# EAGLE design Group5Approved (EAGLE 9.2.0)
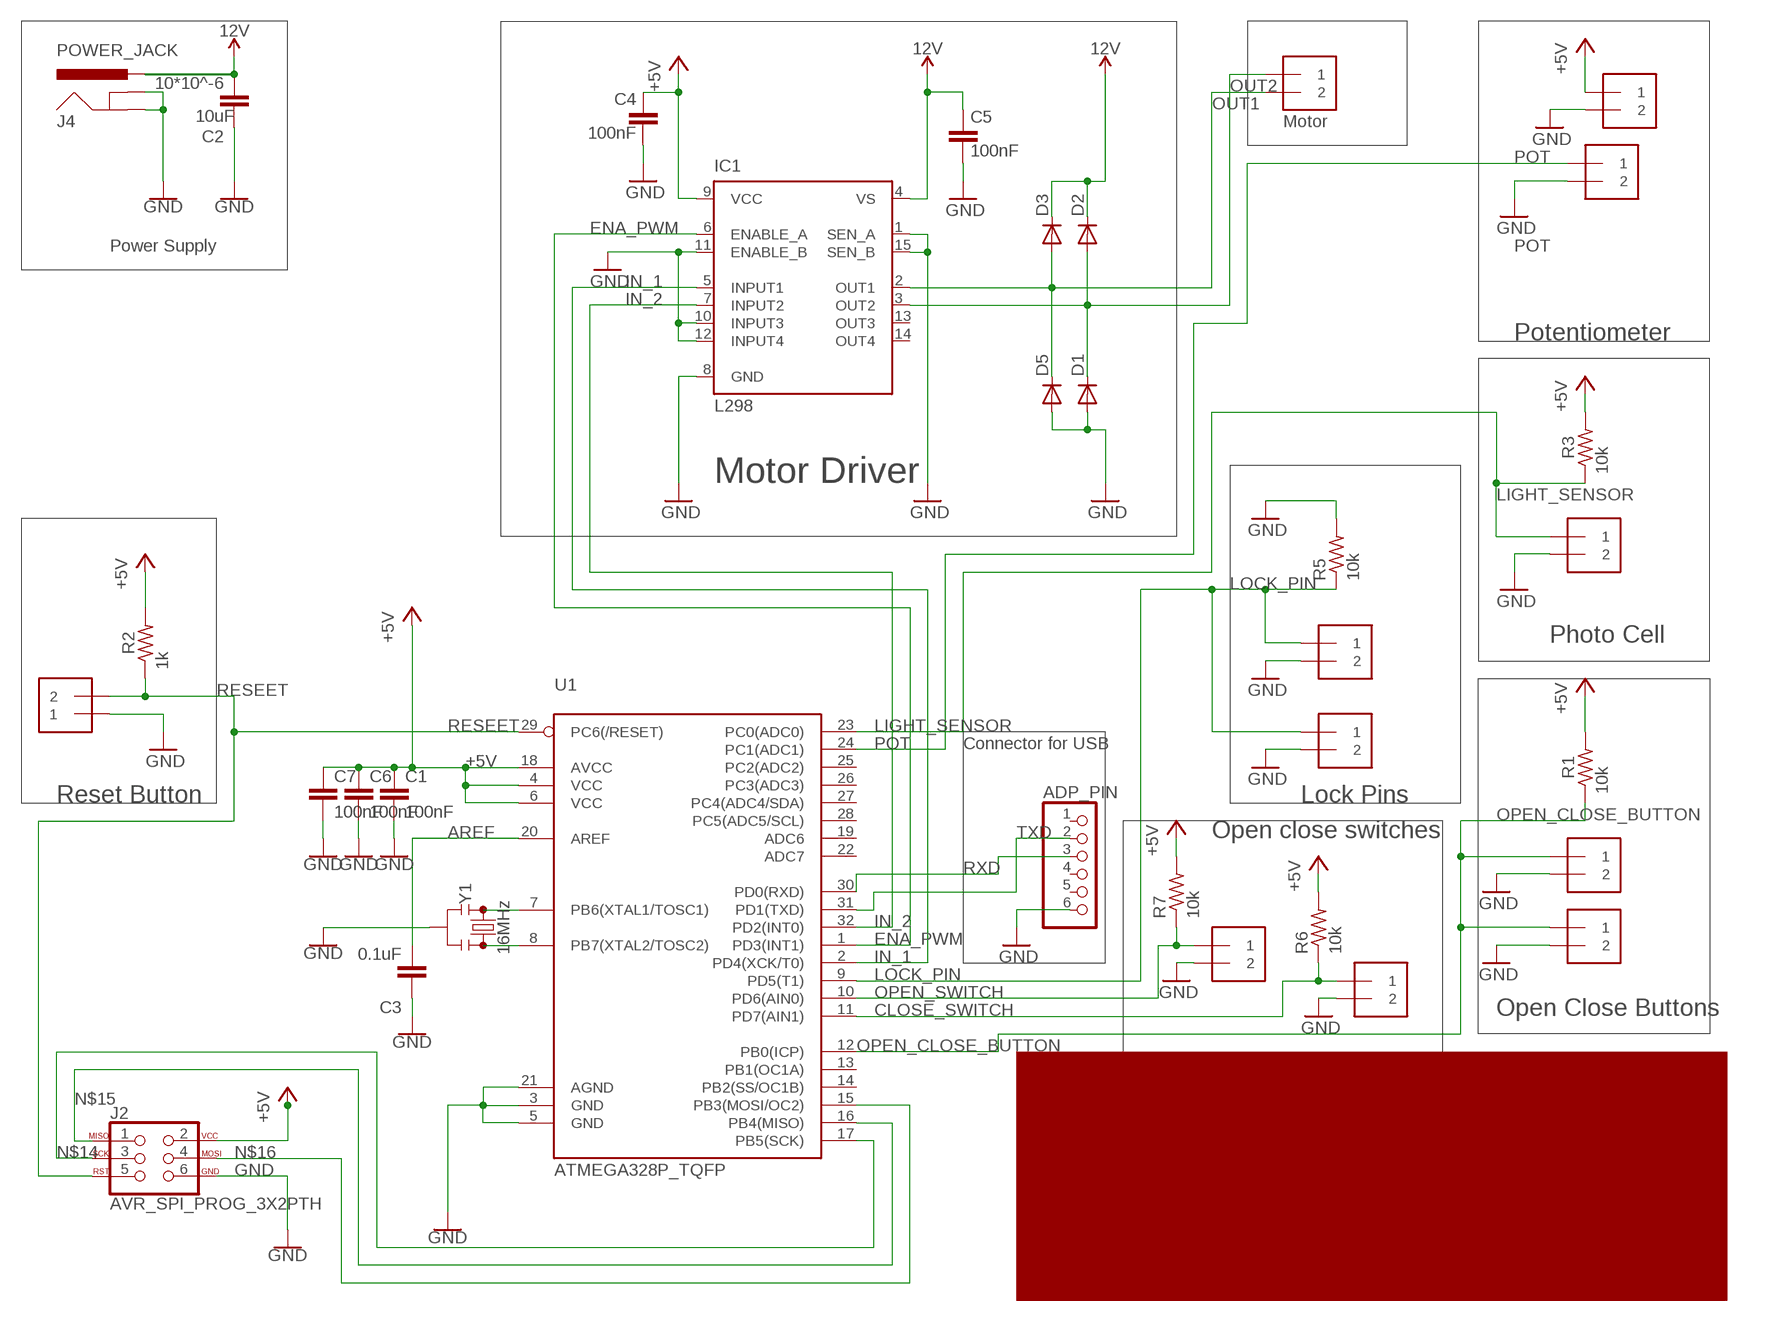
[diagram p0: schematic, sheet 1]

## Parts
ADP_PIN  PINHD-1X6  [1X06]
C1  100nF  C-EUC0805  [C0805]
C2  10*10^-6  C-EUC0805  [C0805]
C3  0.1uF  C-EUC0805  [C0805]
C4  100nF  C-EUC0805  [C0805]
C5  100nF  C-EUC0805  [C0805]
C6  100nF  C-EUC0805  [C0805]
C7  100nF  C-EUC0805  [C0805]
CLOSESWITCH  1X2-3.5MM  [1X2-3.5MM]
D1  DIODE-DO214AA  [DO214AA]
D2  DIODE-DO214AA  [DO214AA]
D3  DIODE-DO214AA  [DO214AA]
D5  DIODE-DO214AA  [DO214AA]
IC1  L298  [MULTIWATT-15]
INSIDE_BUTTON  1X2-3.5MM  [1X2-3.5MM]
J2  AVR_SPI_PROG_3X2PTH  [2X3]
J4  POWER_JACK  [POWER_JACK_PTH]
LIGHT_SENSOR  1X2-3.5MM  [1X2-3.5MM]
LOCK_PIN1  1X2-3.5MM  [1X2-3.5MM]
LOCK_PIN2  1X2-3.5MM  [1X2-3.5MM]
MOTOR  1X2-3.5MM  [1X2-3.5MM]
OPEN_SWITCH  1X2-3.5MM  [1X2-3.5MM]
OUTSIDE_BUTTON  1X2-3.5MM  [1X2-3.5MM]
POT  1X2-3.5MM  [1X2-3.5MM]
POTPOWER  1X2-3.5MM  [1X2-3.5MM]
R1  10k  R-US_M0805  [M0805]
R2  1k  R-US_M0805  [M0805]
R3  10k  R-US_M0805  [M0805]
R5  10k  R-US_M0805  [M0805]
R6  10k  R-US_M0805  [M0805]
R7  10k  R-US_M0805  [M0805]
RESETBUTTON  1X2-3.5MM  [1X2-3.5MM]
U1  ATMEGA328P_TQFP  [TQFP32-08]
Y1  16MHz  RESONATOR-16MHZSMD_3.2X1.3  [RESONATOR-SMD-3.2X1.3]

## Nets
12V [Power]: C2.2 C5.1 D2.C D3.C IC1.4(VS) J4.PWR
+5V: C1.1 C4.1 C6.1 C7.1 IC1.9(VCC) J2.2 POTPOWER.1 R1.2 R2.2 R3.2 R6.2 R7.2 U1.4(VCC) U1.6(VCC) U1.18(AVCC)
AREF: C3.2 U1.20(AREF)
CLOSE_SWITCH: CLOSESWITCH.1 R6.1 U1.11(PD7(AIN1))
ENA_PWM: IC1.6(ENABLE_A) U1.1(PD3(INT1))
GND [gnd]: ADP_PIN.6 C1.2 C2.1 C3.1 C4.2 C5.2 C6.2 C7.2 CLOSESWITCH.2 D1.A D5.A IC1.1(SEN_A) IC1.8(GND) IC1.10(INPUT3) IC1.11(ENABLE_B) IC1.12(INPUT4) IC1.15(SEN_B) INSIDE_BUTTON.2 J2.6 J4.GND J4.GNDBREAK LIGHT_SENSOR.2 LOCK_PIN1.2 LOCK_PIN2.2 OPEN_SWITCH.2 OUTSIDE_BUTTON.2 POT.2 POTPOWER.2 R5.2 RESETBUTTON.1 U1.3(GND) U1.5(GND) U1.21(AGND) Y1.2
IN_1: IC1.5(INPUT1) U1.2(PD4(XCK/T0))
IN_2: IC1.7(INPUT2) U1.32(PD2(INT0))
LIGHT_SENSOR: LIGHT_SENSOR.1 R3.1 U1.23(PC0(ADC0))
LOCK_PIN: LOCK_PIN1.1 LOCK_PIN2.1 R5.1 U1.9(PD5(T1))
N$14: J2.3 U1.17(PB5(SCK))
N$15: J2.1 U1.16(PB4(MISO))
N$16: J2.4 U1.15(PB3(MOSI/OC2))
N$19: U1.7(PB6(XTAL1/TOSC1)) Y1.1
N$20: U1.8(PB7(XTAL2/TOSC2)) Y1.3
OPEN_CLOSE_BUTTON: INSIDE_BUTTON.1 OUTSIDE_BUTTON.1 R1.1 U1.12(PB0(ICP))
OPEN_SWITCH: OPEN_SWITCH.1 R7.1 U1.10(PD6(AIN0))
OUT1 [Motor line]: D3.A D5.C IC1.2(OUT1) MOTOR.2
OUT2 [Motor line]: D1.C D2.A IC1.3(OUT2) MOTOR.1
POT: POT.1 U1.24(PC1(ADC1))
RESEET: J2.5 R2.1 RESETBUTTON.2 U1.29(PC6(/RESET))
RXD: ADP_PIN.3 U1.30(PD0(RXD))
TXD: ADP_PIN.2 U1.31(PD1(TXD))
Unconnected: ADP_PIN.1 ADP_PIN.4 ADP_PIN.5 IC1.13(OUT3) IC1.14(OUT4) U1.13(PB1(OC1A)) U1.14(PB2(SS/OC1B)) U1.19(ADC6) U1.22(ADC7) U1.25(PC2(ADC2)) U1.26(PC3(ADC3)) U1.27(PC4(ADC4/SDA)) U1.28(PC5(ADC5/SCL))

## Notes on the sheet
- Motor
- Power Supply
- Potentiometer
- Motor Driver
- Photo Cell
- Connector for USB
- Reset Button | Lock Pins
- Open close switches
- Open Close Buttons
- Group 5
- Light Controlled Chicken door opener

## Library data of the parts
ADP_PIN = pinhead:PINHD-1X6: PIN HEADER
C1 C3-C7 = rcl:C-EU: CAPACITOR, European symbol; SPICEPREFIX: C
C2 = rcl:C-EU: CAPACITOR, European symbol; SPICEPREFIX: 10uF
CLOSESWITCH INSIDE_BUTTON LIGHT_SENSOR LOCK_PIN1 LOCK_PIN2 MOTOR OPEN_SWITCH OUTSIDE_BUTTON POT POTPOWER RESETBUTTON = adafruit:1X2: 3.5mm Terminal block http://www.ladyada.net/library/pcb/eaglelibrary.html
D1-D3 D5 = diode:DIODE-: DIODE
IC1 = st-microelectronics:L298: DUAL FULL-BRIDGE DRIVER; MPN: L298N; OC_FARNELL: 1589425; OC_NEWARK: 32M1527
J2 = SparkFun-Connectors:AVR_SPI_PROG_3X2: AVR ISP 6 Pin This is the reduced ISP connector for AVR programming. Common on Arduino. This footprint will take up less PCB space and can be used with a 10-pin to 6-pin adapter such as SKU: BOB-08508 **Special note about "TEST_POINT" package. The stop mask is on the top side, so if you want your programming test points to be on the bottom of your board, make sure to place this package on the bottom side of the board. This also ensure that the orientation to program from the bottom side will be correct. SparkFun Products: SparkFun ISP Pogo Adapter <https://www.sparkfun.com/products/11591> - NS Tiny AVR Programmer <https://www.sparkfun.com/products/11801> -PTH
J4 = SparkFun-Connectors:POWER_JACK: Power Jack Connector This is the standard 5.5mm barrel jack for power. The PTH is the most common, proven, reliable, footprint. The Slot footprint only works if the mill layer is transmitted to the PCB fab house so be warned. Here are the connectors we sell at SparkFun: DC Barrel Power Jack/Connector <https://www.sparkfun.com/products/119> (PRT-00119) DC Barrel Power Jack/Connector (SMD) <https://www.sparkfun.com/products/12748> (PRT-12748) DC Barrel Jack Adapter - Breadboard Compatible <https://www.sparkfun.com/products/10811> (PRT-10811) It is used on this SparkFun product (and many, many others): SparkFun RedBoard - Programmed with Arduino <https://www.sparkfun.com/products/12757> (DEV-12757) Also, if you need a mating power supply or connector, please check these out: Wall Adapter Power Supply - 9VDC 650mA <https://www.sparkfun.com/products/298> (TOL-00298) DC Barrel Jack Adapter - Male <https://www.sparkfun.com/products/10287> (PRT-10287); PROD_ID: CONN-08197
R1-R3 R5-R7 = rcl:R-US_: RESISTOR, American symbol; SPICEPREFIX: R
U1 = SparkFun-IC-Microcontroller:ATMEGA328P_TQFP: Popular 328P in QFP Storefront component: ATmega328 - TQFP <https://www.sparkfun.com/products/13448> (COM-13448) Datasheet <http://www.sparkfun.com/datasheets/Components/SMD/ATMega328.pdf> SparkFun Products SparkFun RedBoard - Programmed with Arduino <https://www.sparkfun.com/products/12757> (DEV-12757) Arduino Pro Mini 328 - 5V/16MHz <https://www.sparkfun.com/products/11113> (DEV-11113) Arduino Pro Mini 328 - 3.3V/8MHz <https://www.sparkfun.com/products/11114> (DEV-11114) SparkFun OpenLog <https://www.sparkfun.com/products/13712> (DEV-13712) SparkFun MicroView - OLED Arduino Module <https://www.sparkfun.com/products/12923> (DEV-12923) SparkFun Digital Sandbox <https://www.sparkfun.com/products/12651> (DEV-12651) SparkFun PicoBoard <https://www.sparkfun.com/products/11888> (WIG-11888) Arduino Fio <https://www.sparkfun.com/products/10116> (DEV-10116) LilyPad Arduino 328 Main Board <https://www.sparkfun.com/products/13342> (DEV-13342) SparkFun RedStick <https://www.sparkfun.com/products/13741> (DEV-13741) LilyPad MP3 <https://www.sparkfun.com/products/11013> (DEV-11013) LilyPad Arduino SimpleSnap <https://www.sparkfun.com/products/10941> (DEV-10941) SparkFun Stepoko <https://www.sparkfun.com/products/13899> (ROB-13899) SparkFun Geiger Counter <https://www.sparkfun.com/products/11345> (SEN-11345) SparkFun EL Sequencer <https://www.sparkfun.com/products/12781> (COM-12781) Arduino Pro 328 - 5V/16MHz <https://www.sparkfun.com/products/10915> (DEV-10915) CryptoCape <https://www.sparkfun.com/products/12773> (DEV-12773) SparkFun IR Thermometer Evaluation Board - MLX90614 <https://www.sparkfun.com/products/10740> (SEN-10740) SparkFun RedBot Mainboard <https://www.sparkfun.com/products/12097> (ROB-12097) Arduino Pro 328 - 3.3V/8MHz <https://www.sparkfun.com/products/10914> (DEV-10914) SparkFun Block for Intel® Edison - Arduino <https://www.sparkfun.com/products/13036> (DEV-13036) SparkFun Simon Says - Surface Mount Soldering Kit <https://www.sparkfun.com/products/10935> (KIT-10935) SparkFun 7-Segment Serial Display - Red <https://www.sparkfun.com/products/11441> (COM-11441) SparkFun 7-Segment Serial Display - White <https://www.sparkfun.com/products/11629> (COM-11629) SparkFun 7-Segment Serial Display - Yellow <https://www.sparkfun.com/products/11443> (COM-11443) SparkFun 7-Segment Serial Display - Kelly Green <https://www.sparkfun.com/products/11440> (COM-11440) SparkFun 7-Segment Serial Display - Blue <https://www.sparkfun.com/products/11442> (COM-11442) SparkFun OpenSegment Serial Display - 20mm (Blue) <https://www.sparkfun.com/products/11647> (COM-11647) SparkFun OpenSegment Serial Display - 20mm (Green) <https://www.sparkfun.com/products/11646> (COM-11646) SparkFun OpenSegment Serial Display - 20mm (White) <https://www.sparkfun.com/products/11648> (COM-11648) SparkFun OpenSegment Serial Display - 20mm (Red) <https://www.sparkfun.com/products/11644> (COM-11644) SparkFun OpenSegment Serial Display - 20mm (Yellow) <https://www.sparkfun.com/products/11645> (COM-11645) SparkFun OpenSegment Shield <https://www.sparkfun.com/products/13190> (DEV-13190); PROD_ID: IC-09069
Y1 = SparkFun-Clocks:RESONATOR-16MHZ: 16MHz Resonator Digikey Example <http://www.digikey.com/product-detail/en/murata-electronics-north-america/CSTCE16M0V53-R0/490-1198-1-ND/584635> Frequency: 16MHz Frequency Stability: ±0.3% Frequency Tolerance: ±0.5% Capacitance: 15pF SparkFun Products SparkFun OpenLog <https://www.sparkfun.com/products/13712> SparkFun MicroView - OLED Arduino Module <https://www.sparkfun.com/products/12923>; PROD_ID: XTAL-08900

## Net classes
0 default: width 0.1 mm, drill 0.8 mm, clearance 0.152 mm
1 Power: width 1.27 mm, drill 0.8 mm, clearance 0.152 mm
2 gnd: width 0.03 mm, drill 0.559 mm, clearance 0.152 mm
3 Motor line: width 0.12 mm, drill 0.8 mm, clearance 0.2 mm

## Board
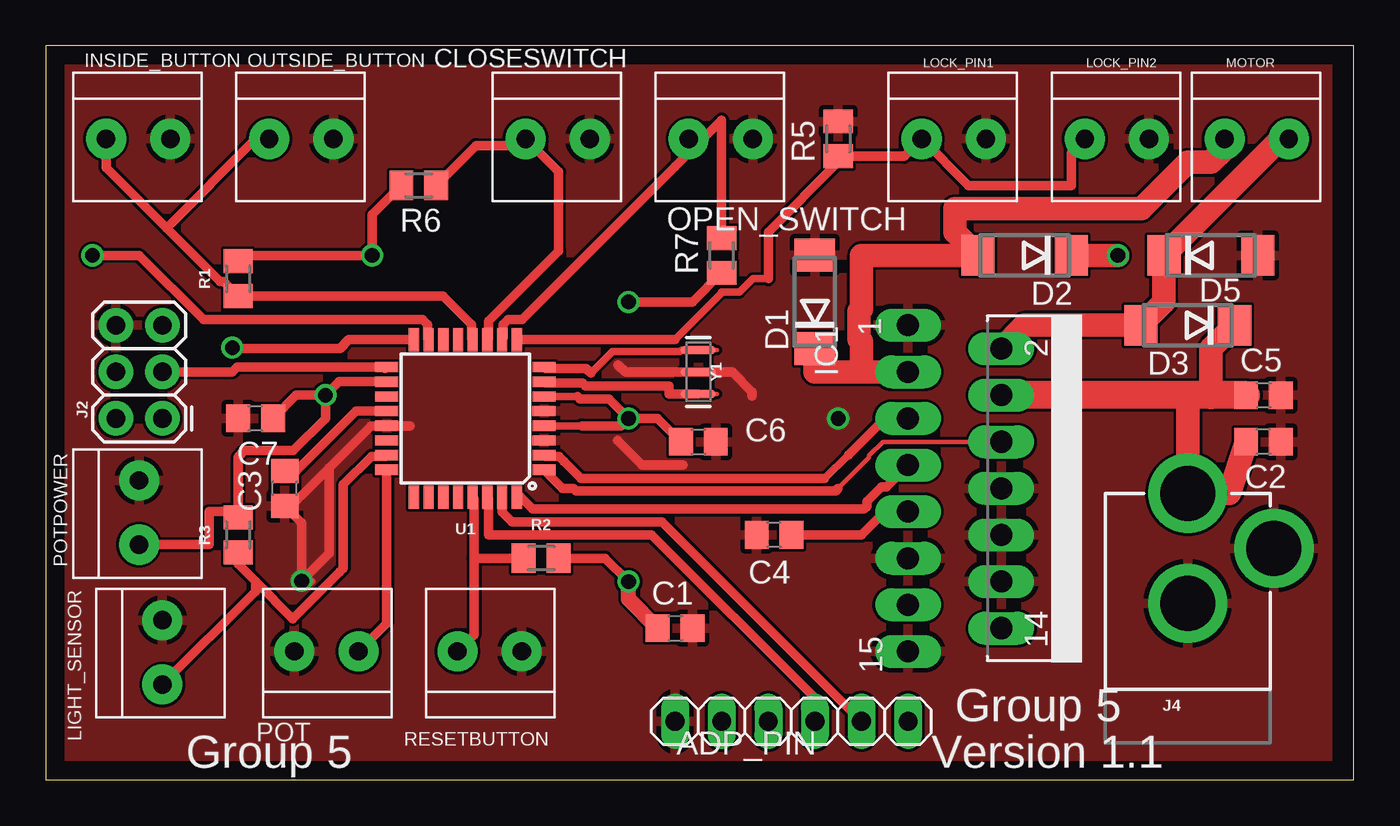
[diagram p1: board, top side]
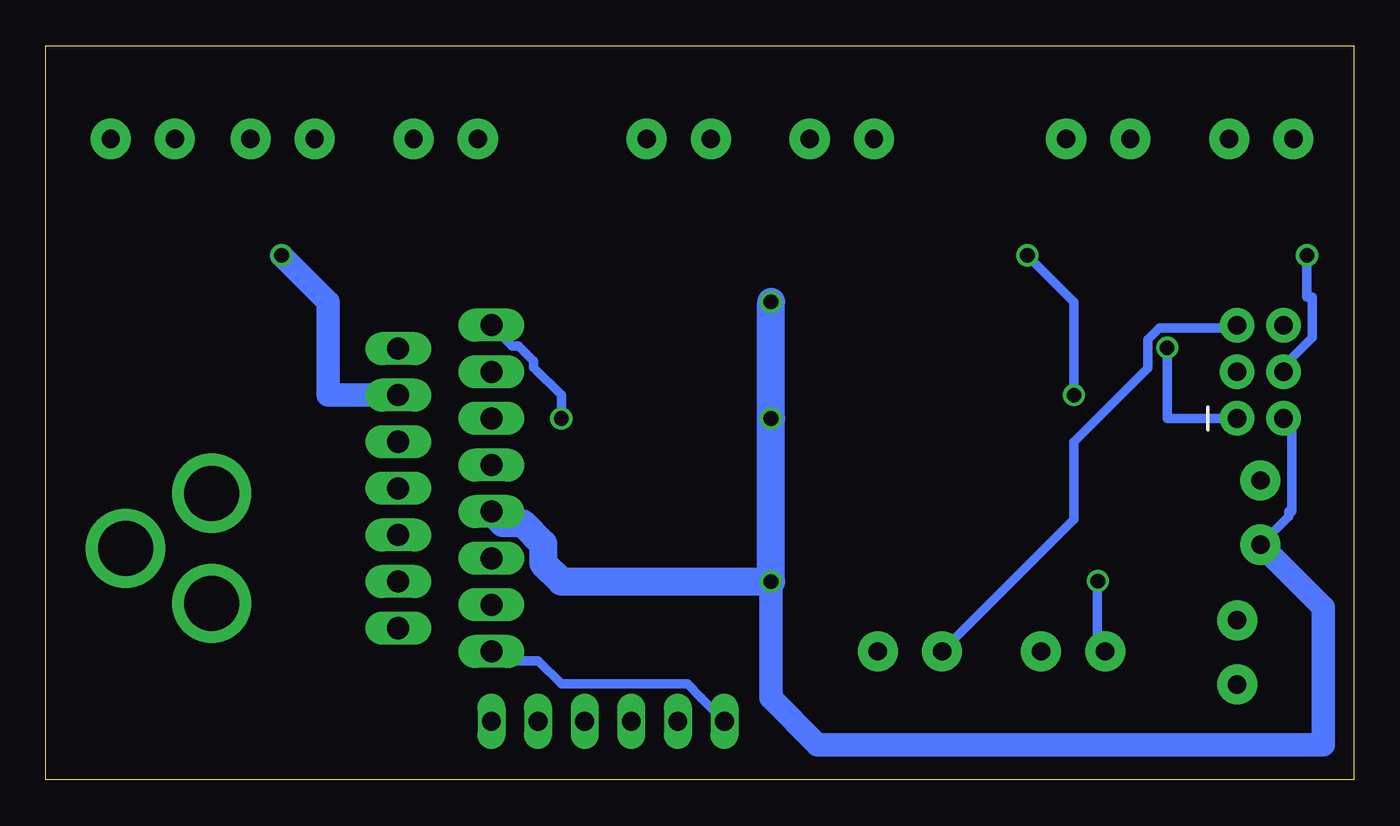
[diagram p2: board, bottom side, seen from below]

Size 71.27 x 40 mm. Coordinates in mm from the lower left corner, seen from the top.
Outline: 0,0 71.27,0 71.27,40 0,40 0,0
Copper layers (1*16): Top 0.035mm / dielectric 1.5mm / Bottom 0.035mm
Design rules "default": minimum track width 6mil, minimum drill 0.35mm, track to track 6mil, track to pad 6mil, pad to pad 6mil, via to via 6mil, smd to smd 6mil, copper to edge 40mil, drill to drill 6mil, minimum pad ring 10mil, minimum via ring 8mil, stop-mask expansion 4mil, vias tented up to drill 0mil, thermal gap 10mil

### Footprints (pad centres in the part's own frame; a part is rotated, then mirrored left to right if it is on the bottom)
1X06 = drill 1.016 long: 1 -6.35,0; 2 -3.81,0; 3 -1.27,0; 4 1.27,0; 5 3.81,0; 6 6.35,0
C0805 = smd 1.3 x 1.5: 1 -0.95,0; 2 0.95,0
1X2-3.5MM = drill 1 pad 2.184: 1 1.8,0; 2 -1.7,0
DO214AA = smd 1.8 x 2.2: A 2.55,0; C -2.55,0
MULTIWATT-15 = drill 1.2 long: 1 -8.89,-7.62; 2 -7.62,-2.54; 3 -6.35,-7.62; 4 -5.08,-2.54; 5 -3.81,-7.62; 6 -2.54,-2.54; 7 -1.27,-7.62; 8 0,-2.54; 9 1.27,-7.62; 10 2.54,-2.54; 11 3.81,-7.62; 12 5.08,-2.54; 13 6.35,-7.62; 14 7.62,-2.54; 15 8.89,-7.62
2X3 = drill 1.016 pad 1.88: 1 0,0; 2 0,2.54; 3 2.54,0; 4 2.54,2.54; 5 5.08,0; 6 5.08,2.54
POWER_JACK_PTH = drill 2.997 pad 4.318: GND 0,7.7; GNDBREAK 4.7,10.7; PWR 0,13.7
M0805 = smd 1.3 x 1.6: 1 -0.95,0; 2 0.95,0
TQFP32-08 = smd 1.27 x 0.559: 1 -4.293,2.8; 2 -4.293,2; 3 -4.293,1.2; 4 -4.293,0.4; 5 -4.293,-0.4; 6 -4.293,-1.2; 7 -4.293,-2; 8 -4.293,-2.8; 17 4.293,-2.8; 18 4.293,-2; 19 4.293,-1.2; 20 4.293,-0.4; 21 4.293,0.4; 22 4.293,1.2; 23 4.293,2; 24 4.293,2.8 | smd 0.559 x 1.27: 9 -2.8,-4.293; 10 -2,-4.293; 11 -1.2,-4.293; 12 -0.4,-4.293; 13 0.4,-4.293; 14 1.2,-4.293; 15 2,-4.293; 16 2.8,-4.293; 25 2.8,4.293; 26 2,4.293; 27 1.2,4.293; 28 0.4,4.293; 29 -0.4,4.293; 30 -1.2,4.293; 31 -2,4.293; 32 -2.8,4.293
RESONATOR-SMD-3.2X1.3 = smd 0.45 x 1.905: 1 -1.2,0; 2 0,0; 3 1.2,0

### Placement (x,y rotation side)
ADP_PIN  40.64,3.18 180 top
C1  34.29,8.26 0 top
C2  66.36,18.42 180 top
C3  13.02,15.88 90 top
C4  39.69,13.34 180 top
C5  66.36,20.96 0 top
C6  35.56,18.42 0 top
C7  11.43,19.69 180 top
CLOSESWITCH  27.94,34.93 180 top
D1  41.91,26.04 90 top
D2  53.34,28.58 180 top
D3  62.23,24.77 180 top
D5  63.49,28.58 0 top
IC1  54.61,15.88 270 top
INSIDE_BUTTON  5.08,34.93 180 top
J2  6.35,19.69 90 top
J4  62.23,1.91 0 top
LIGHT_SENSOR  6.35,6.99 270 top
LOCK_PIN1  49.53,34.93 180 top
LOCK_PIN2  58.42,34.93 180 top
MOTOR  66.04,34.93 180 top
OPEN_SWITCH  36.83,34.93 180 top
OUTSIDE_BUTTON  13.97,34.93 180 top
POT  15.24,6.99 0 top
POTPOWER  5.08,14.61 270 top
R1  10.48,27.31 90 top
R2  26.99,12.07 0 top
R3  10.48,13.34 90 top
R5  43.18,34.93 90 top
R6  20.32,32.39 180 top
R7  36.83,28.58 270 top
RESETBUTTON  24.13,6.99 0 top
U1  22.86,19.69 180 top
Y1  35.56,22.23 90 top

### Tracks (layer width: path | path; a pad name or v marks a point on that pad's centre or on a via)
12V  (via drill 0.8)
  Top 1.27: v58.42,28.58 D2.C | D3.C 63.5,23.49 63.5,20.96 | 62.23,20.96 J4.PWR 64.5,15.61 C2.2
  Top 1.524: C5.1 63.5,20.96 62.23,20.96 IC1.4
  Bottom 1.27: v58.42,28.58 55.88,26.04 55.88,20.96 IC1.4
+5V  (via drill 0.8)
  Top 0.406: U1.4 29.21,19.29 | U1.6 28.98,20.89
  Top 0.508: R1.2 10.8,28.58 v17.78,28.58 17.78,30.8 R6.2 | v31.75,10.8 30.48,12.07 R2.2 | v31.75,26.04 35.24,26.04 R7.2 | v15.24,20.96 15.24,19.69 13.48,17.93 10.81,17.93 10.48,17.6 R3.2 10.48,14.61 8.89,14.61 8.89,12.81 POTPOWER.1 | 28.98,20.89 29.12,20.74 30.7,20.74 v31.75,19.69 | 29.21,19.29 31.35,19.29 v31.75,19.69 | U1.18 15.97,21.69 v15.24,20.96 | C4.1 44.45,13.34 45.72,14.61 IC1.9 | C7.1 13.65,20.96 v15.24,20.96 | C6.1 33.34,19.69 v31.75,19.69
  Top 0.813: C1.1 31.75,9.85 v31.75,10.8
  Bottom 0.508: v17.78,28.58 15.24,26.04 v15.24,20.96 | POTPOWER.1 3.54,14.34 3.54,14.61 3.38,14.61 3.38,19.69 J2.2
  Bottom 1.27: v31.75,10.8 31.75,4.45 29.21,1.91 1.65,1.91 1.65,9.38 POTPOWER.1
  Bottom 1.524: IC1.9 46.37,13.99 45.3,13.99 44.17,12.86 44.17,11.79 43.18,10.8 v31.75,10.8 v31.75,19.69 v31.75,26.04
AREF
  Top 0.508: C3.2 13.65,16.83 16.91,20.09 U1.20
CLOSE_SWITCH
  Top 0.508: R6.1 23.44,34.56 25.77,34.56 CLOSESWITCH.1 27.94,33.13 27.94,28.82 24.13,25.01 24.13,24.05 U1.11
ENA_PWM
  Top 0.254: 43.18,15.88 44.86,17.56 44.86,17.66 45.62,18.42 IC1.6
  Top 0.508: 43.18,15.88 43.05,15.75 28.89,15.75 28.76,15.88 28.16,15.88 U1.1
GND  (via drill 0.8)
  Top 0.406: v13.94,10.83 13.97,10.8 14.48,10.8
  Top 0.508: 19.84,19.28 17.72,19.28 15.45,17 | 15.45,17 13.38,14.93 C3.1 13.94,14.01 v13.94,10.83 15.45,12.33 15.45,17 | 31.18,22.61 31.58,22.21 37.41,22.21 38.48,21.14 38.48,20.92 | 31.16,18.48 32.48,17.16 34.73,17.16
  Bottom 0.508: POT.2 13.97,7.42 13.97,10.8 v13.94,10.83 | v43.18,19.69 43.18,20.96 44.68,22.46 44.68,22.81 45.51,23.64 45.86,23.64 IC1.1 | ADP_PIN.6 35.56,4.45 35.56,4.47 36.3,5.21 43.18,5.21 44.45,6.48 46.48,6.48 IC1.15
  pour Top: 0,40.01 0,-0.63 69.85,-0.63 69.85,40.01
IN_1
  Top 0.406: 42.44,16.41 43.73,17.7
  Top 0.508: IC1.5 45.72,19.69 43.73,17.7 | U1.2 27.22,17.62 27.98,17.62 28.24,17.36 28.24,17.34 29.17,16.41 42.44,16.41
IN_2
  Top 0.508: U1.32 25.88,15.4 26.52,14.76 44.6,14.76 44.74,14.9 44.74,15.17 45.53,15.96 45.8,15.96 IC1.7
LIGHT_SENSOR
  Top 0.508: U1.23 18.5,17.62 17.74,17.62 16.21,16.09 16.21,14.61 16.21,11.52 16,11.31 13.46,8.77 11.43,10.8 | R3.1 10.48,11.75 11.43,10.8 | LIGHT_SENSOR.1 11.43,10.27 11.43,10.8
LOCK_PIN
  Top 0.406: 34.29,23.98 36.83,26.52 36.83,26.58 37.8,26.58 38.53,27.31 39.37,27.31
  Top 0.508: U1.9 34.29,23.98 | 39.37,27.31 39.37,29.85 43.18,33.66 R5.1 46.78,33.98 LOCK_PIN1.1 50.27,32.39 55.88,32.39 55.88,34.19 LOCK_PIN2.1
N$14
  Top 0.508: 18.5,22.42 U1.17 17.78,22.49 10.42,22.49 10.16,22.23 J2.3
N$15  (via drill 0.8)
  Top 0.508: U1.16 16.51,23.98 16.03,23.5 10.16,23.5 v10.16,23.55
  Bottom 0.508: v10.16,23.55 10.16,19.69 J2.1
N$16  (via drill 0.8)
  Top 0.508: U1.15 20.79,24.05 20.79,24.81 20.53,25.07 8.59,25.07 5.08,28.58 v2.54,28.58
  Bottom 0.508: v2.54,28.58 2.54,26.32 2.26,26.32 2.26,24.1 3.81,22.55 J2.4
N$19
  Top 0.508: U1.7 27.22,21.62 29.25,21.62 29.42,21.45 33.96,21.45 33.96,21.03 Y1.1
N$20
  Top 0.406: 29.71,22.16 30.88,23.33 34.56,23.33 34.67,23.43 Y1.3
  Top 0.508: U1.8 27.22,22.42 29.45,22.42 29.71,22.16
OPEN_CLOSE_BUTTON
  Top 0.508: U1.12 23.19,24.05 23.19,24.81 21.64,26.36 R1.1 9.68,27.16 9.49,27.16 6.57,30.07 | 6.57,30.07 3.28,33.37 INSIDE_BUTTON.1 | 6.57,30.07 11.43,34.93 OUTSIDE_BUTTON.1
OPEN_SWITCH
  Top 0.508: 35.03,34.15 OPEN_SWITCH.1 | U1.10 24.93,24.05 24.93,24.81 25.19,25.07 25.95,25.07 34.29,33.41 35.03,34.15 | 35.03,34.15 36.83,35.95 R7.1
OUT1
  Top 1.27: IC1.2 53.34,24.77 D3.A 60.94,26.03 D5.C 67.29,34.93 MOTOR.2
OUT2
  Top 1.27: IC1.3 44.45,22.23 | 44.45,22.23 41.91,22.23 D1.C | 44.45,22.23 44.45,23.88 44.3,24.03 44.3,25.51 44.45,25.66 44.45,28.58 D2.A 49.53,29.84 49.53,31.12 59.69,31.12 62.23,33.66 63.5,33.66 64.24,34.4 MOTOR.1
POT
  Top 0.508: U1.24 18.57,8.52 POT.1
RESEET
  Top 0.508: 23.33,12.07 23.33,7.89 RESETBUTTON.2 | U1.29 23.33,15.33 23.33,12.07 | R2.1 23.33,12.07
  Bottom 0.508: J2.5 6.52,24.6 10.6,24.6 11.22,23.98 11.22,22.44 15.24,18.42 15.24,14.18 RESETBUTTON.2
RXD
  Top 0.508: U1.30 24.13,15.33 24.13,14.57 24.13,13.34 33.02,13.34 41.91,4.45 ADP_PIN.3
TXD
  Top 0.508: ADP_PIN.2 33.58,14.05 27.94,14.05 25.4,14.05 24.86,14.59 U1.31

### Text on the board
tPlace: Group 5 | Group 5 | Version 1.1
tCream: OPENSWITCH